# EAGLE design prototype_v6 (EAGLE 9.6.2)
AUTHOR: Cole Stanton / Aaron Tran; BOARD_NAME: 507 PROTOTYPE; DOC_NUM: 1; PROJECT_NAME: 507 DESIGN PROJECT; REVISION: 0
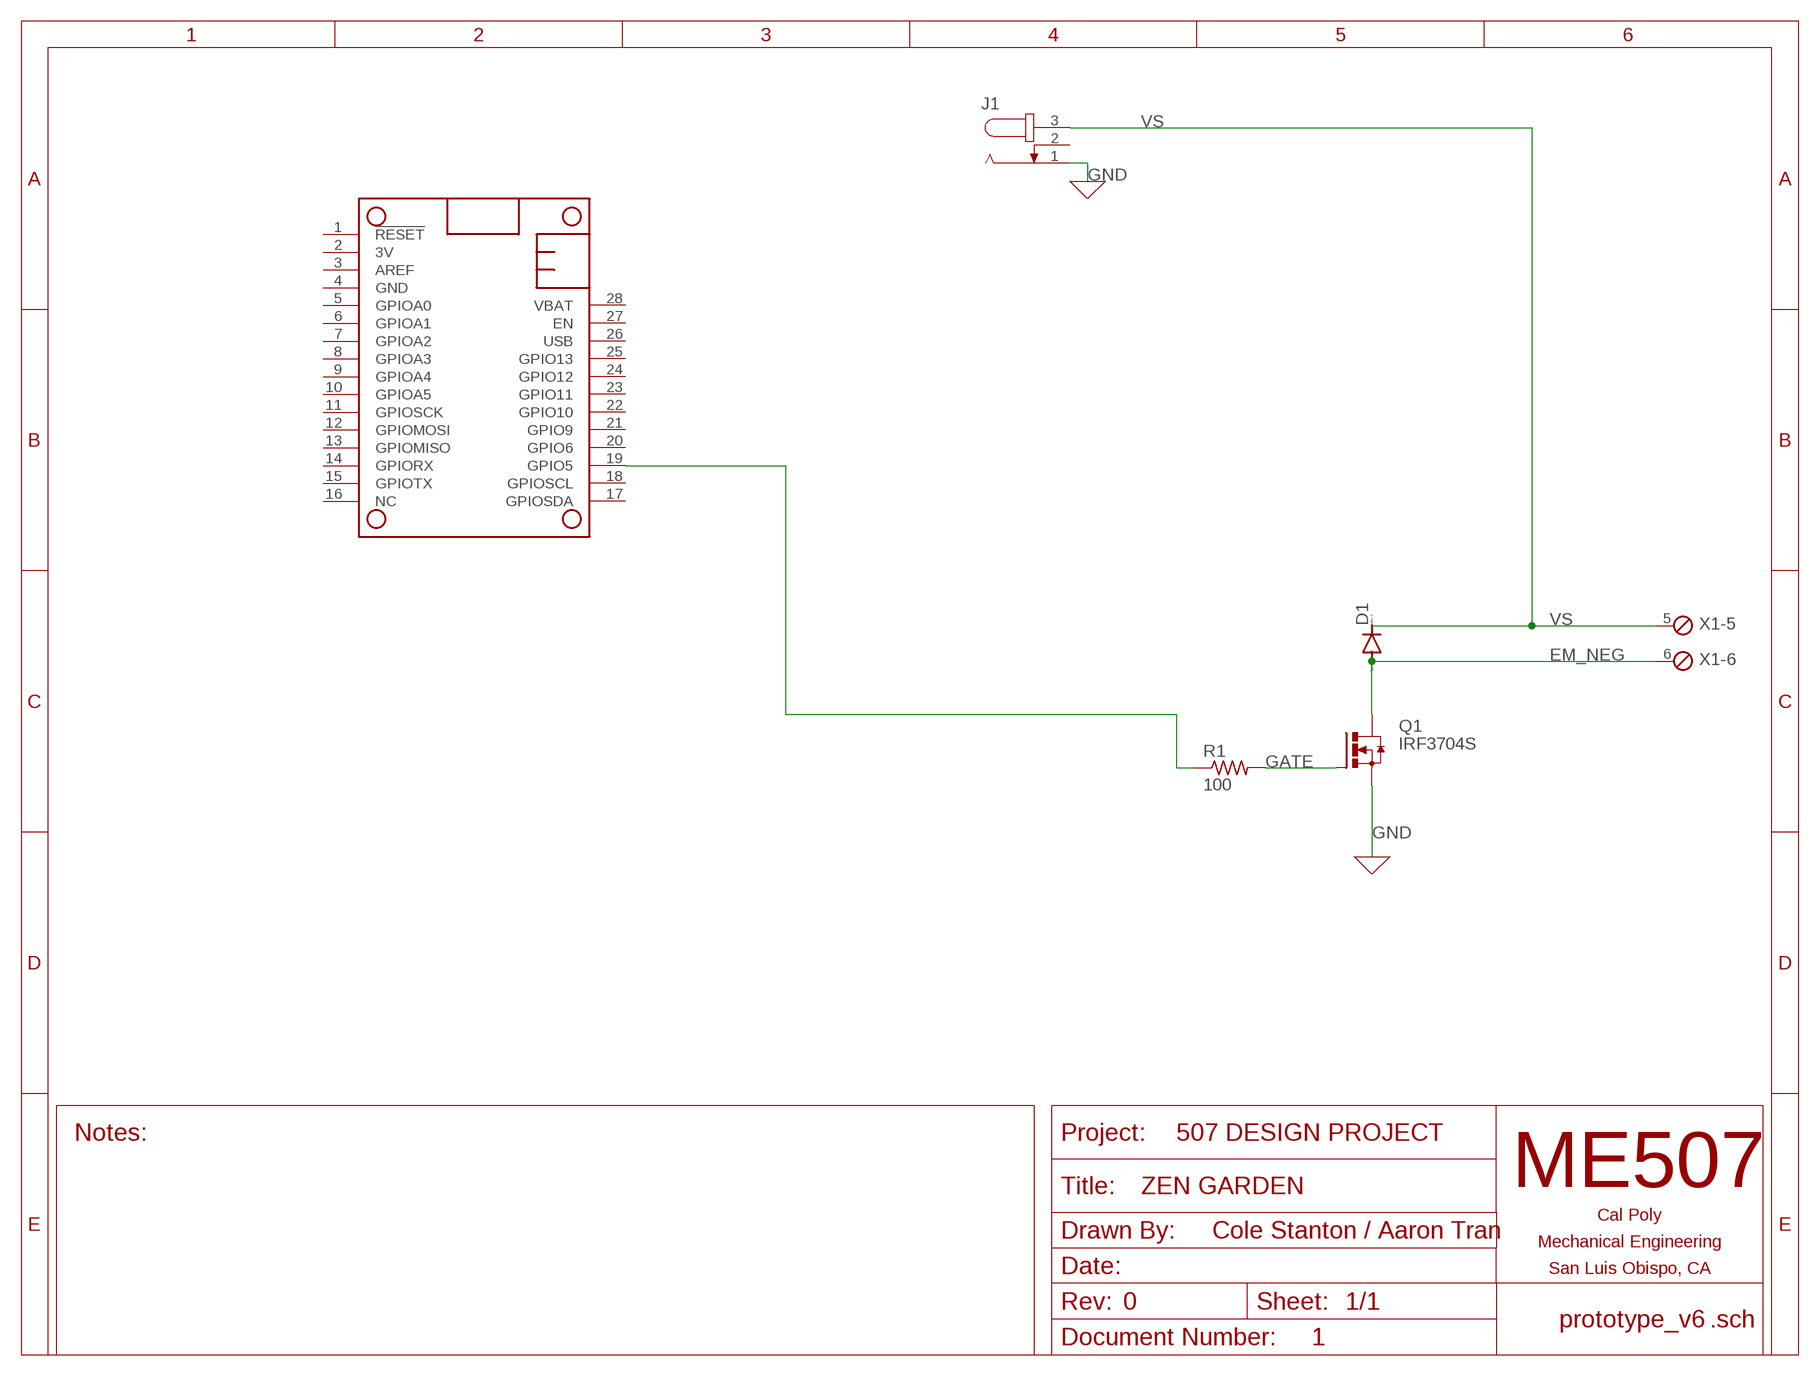
[diagram p0: schematic, sheet 1]
FRAME1 (TITLEBLOCK_LET_L): BOARD_NAME: ZEN GARDEN

## Parts
D1  DIODE-DO-214AC  [DO-214AC]
J1  JACK-PLUG1  [SPC4078]
MS1  FEATHERWINGEXTENDED_BOTH_ENDS  [FEATHERWING]
Q1  IRF3704S  [D2PACK]
R1  100  R-US_R0805  [R0805]
X1  SCREWTERM_6P_381  [6POL381]

## Nets
EM_NEG: D1.A Q1.2(D) X1.6
GATE: Q1.1(G) R1.2
GND: J1.1 Q1.3(S)
N$21: MS1.19(GPIO5) R1.1
VS: D1.C J1.3 X1.5
Unconnected: J1.2 MS1.1(!RESET) MS1.2(3V) MS1.3(AREF) MS1.5(GPIOA0) MS1.6(GPIOA1) MS1.7(GPIOA2) MS1.8(GPIOA3) MS1.9(GPIOA4) MS1.10(GPIOA5) MS1.11(GPIOSCK) MS1.12(GPIOMOSI) MS1.13(GPIOMISO) MS1.14(GPIORX) MS1.15(GPIOTX) MS1.16(NC) MS1.17(GPIOSDA) MS1.18(GPIOSCL) MS1.20(GPIO6) MS1.21(GPIO9) MS1.22(GPIO10) MS1.23(GPIO11) MS1.24(GPIO12) MS1.25(GPIO13) MS1.26(USB) MS1.27(EN) MS1.28(VBAT) X1.1 X1.2 X1.3 X1.4

## Power pins joined to a net without a drawn wire
GND: MS1.4(GND)

## Library data of the parts
D1 = diode:DIODE-: DIODE
J1 = con-jack:JACK-PLUG: DC POWER JACK Power Jack, DC, Right Angle, Through Hole, Rated 5A at 16VDC, PC Terminals Distributor: Farnell (www.Farnell.de) Drawing: 84N1161.pdf / 84N1162.pdf Manufacturer: SPC Technology (www.spctechnology.com) Type: SPC4077 / SPC 4078; OC_FARNELL: unknown; OC_NEWARK: unknown
MS1 = ME507:FEATHERWING: AdaFruitTM Feather Wing A modified version of a Featherwing, the add-on board for an AdaFruit(tm) Feather development board. There is a standard size version which is the same size as the Feather board on which the microcontroller hangs out. There is also an extended version, with each and longer by a quarter inch to allow for connectors such as screw terminals which aren't hidden under another board if this wing isn't on the top of the board stack. The pins are named in a generic fashion; these names do not necessarily correspond to Arduino or Python pin numbers. The designer must refer to the pinout diagram for each specific Feather board to find the functions of each pin.
Q1 = transistor-power:IRF3704: SMPS MOSFET HEXFET® Power MOSFET Source: http://www.irf.com/product-info/datasheets/data/irf3704.pdf
R1 = rcl:R-US_: RESISTOR, American symbol; SPICEPREFIX: R
X1 = ME507 (1):SCREWTERM_6P: Screw Terminal Block This part is designed for a screw terminal connector. The 2.54mm (0.100 inch) foorprint can also be used for male or female pin headers such as those on most development boards. One can also solder wires directly into the holes, though this makes modifications or repairs to the system more inconvenient. Larger versions can carry more current.

## Board
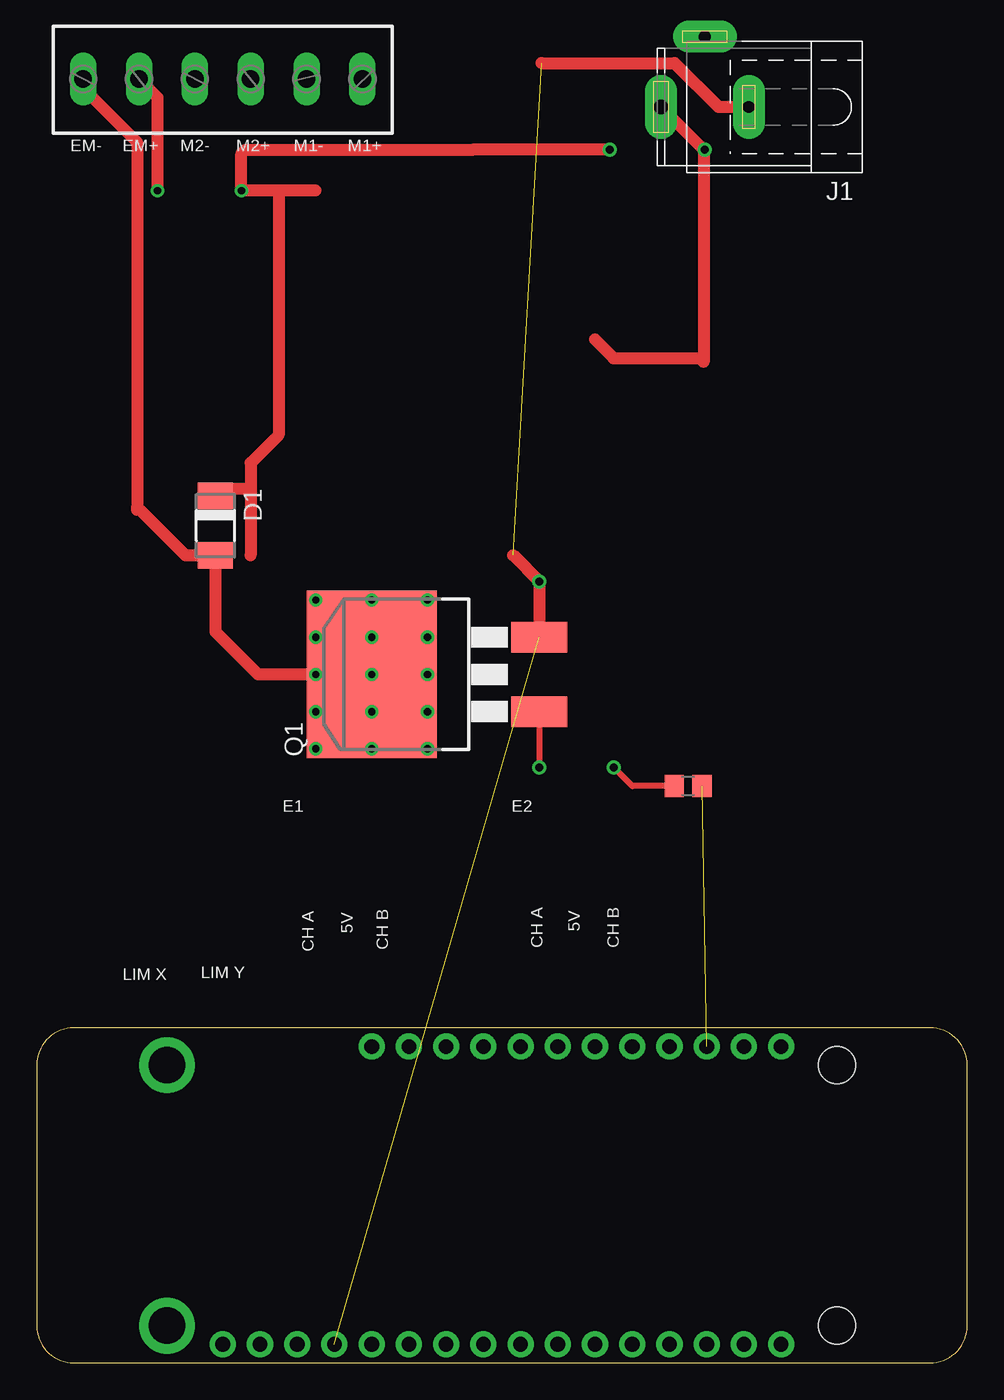
[diagram p1: board, top side]
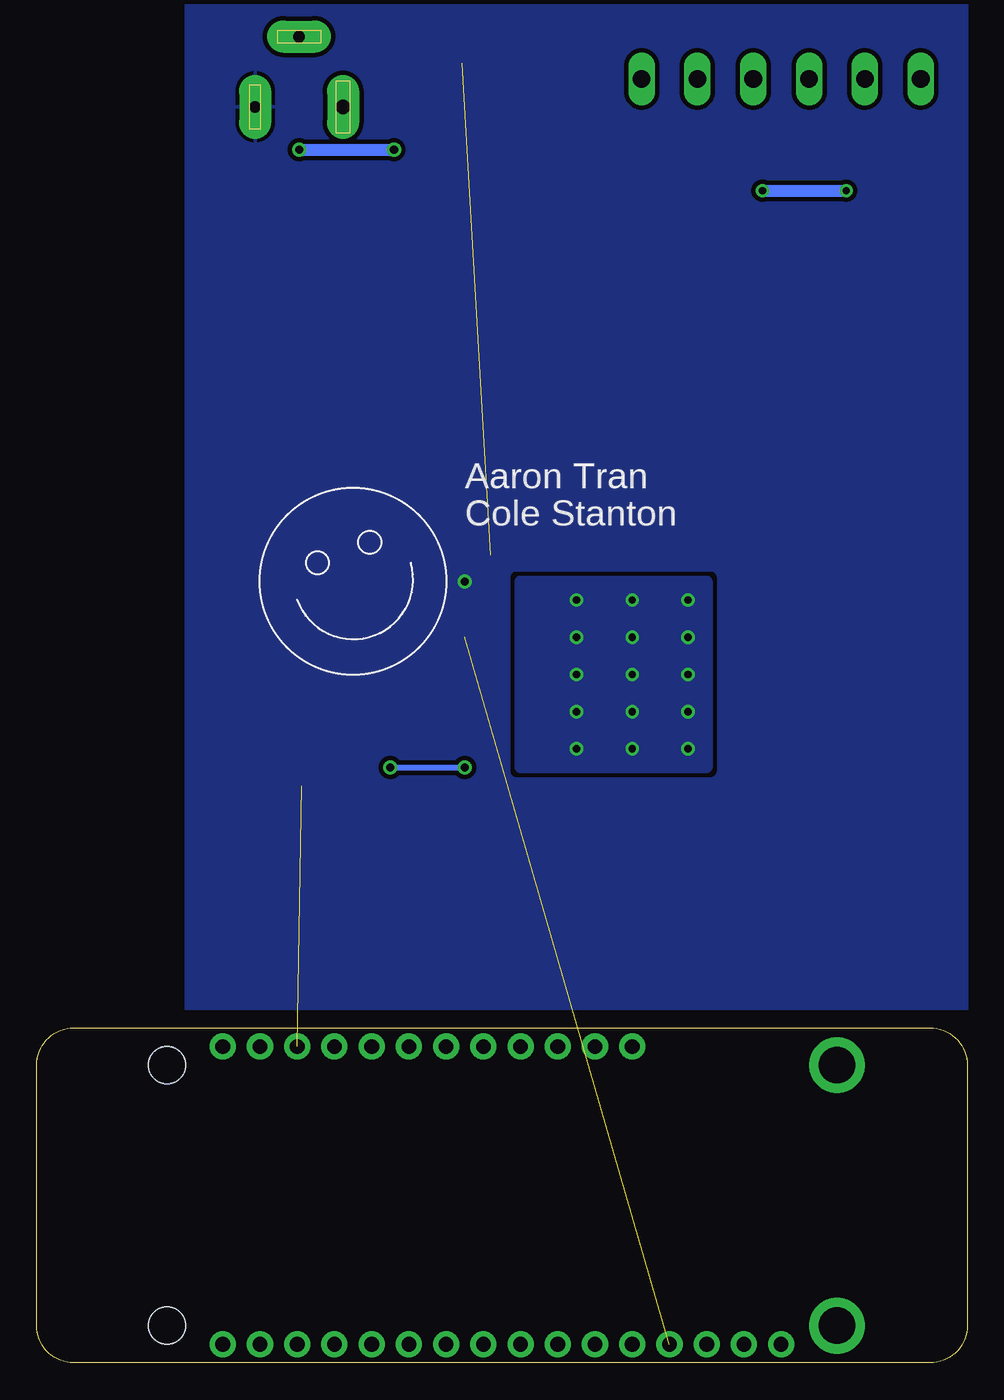
[diagram p2: board, bottom side, seen from below]

Size 63.5 x 22.86 mm. Coordinates in mm from the lower left corner, seen from the top.
Copper layers (1*16): Top 0.035mm / dielectric 1.5mm / Bottom 0.035mm
Design rules "default": minimum track width 6mil, minimum drill 0.35mm, track to track 6mil, track to pad 6mil, pad to pad 6mil, via to via 6mil, smd to smd 6mil, copper to edge 40mil, drill to drill 6mil, minimum pad ring 10mil, minimum via ring 8mil, stop-mask expansion 4mil, vias tented up to drill 0mil, thermal gap 10mil

### Footprints (pad centres in the part's own frame; a part is rotated, then mirrored left to right if it is on the bottom)
DO-214AC = smd 1.8 x 2.4: A 2.025,0; C -2.025,0
SPC4078 = drill 0.8 pad 2.184 long: 1 -3,0; 2 0,-4.8 | drill 1 pad 2.184 long: 3 3,0
FEATHERWING = drill 1 pad 1.778: 1 6.35,1.27; 2 8.89,1.27; 3 11.43,1.27; 4 13.97,1.27; 5 16.51,1.27; 6 19.05,1.27; 7 21.59,1.27; 8 24.13,1.27; 9 26.67,1.27; 10 29.21,1.27; 11 31.75,1.27; 12 34.29,1.27; 13 36.83,1.27; 14 39.37,1.27; 15 41.91,1.27; 16 44.45,1.27; 17 44.45,21.59; 18 41.91,21.59; 19 39.37,21.59; 20 36.83,21.59; 21 34.29,21.59; 22 31.75,21.59; 23 29.21,21.59; 24 26.67,21.59; 25 24.13,21.59; 26 21.59,21.59; 27 19.05,21.59; 28 16.51,21.59 | drill 2.5 pad 3.81: P$1 2.54,20.32; P$2 2.54,2.54 | hole 2.54: 48.26,20.32; 48.26,2.54
D2PACK = smd 2.083 x 3.81: 1 -2.54,-8.89; 3 2.54,-8.89 | smd 11.43 x 8.89: 2 0,2.54
R0805 = smd 1.3 x 1.5: 1 -0.95,0; 2 0.95,0
6POL381 = drill 1.2 pad 1.778 long: 1 -9.525,0; 2 -5.715,0; 3 -1.905,0; 4 1.905,0; 5 5.715,0; 6 9.525,0

### Placement (x,y rotation side)
D1  12.19,57.15 270 top  (outside the outline)
J1  45.59,85.72 180 top  (outside the outline)
MS1  6.35,0 0 top
Q1  25.4,46.99 90 top  (outside the outline)
R1  44.45,39.37 180 top  (outside the outline)
X1  12.7,87.63 180 top  (outside the outline)

### Tracks (layer width: path | path; a pad name or v marks a point on that pad's centre or on a via)
EM_NEG
  Top 0.813: X1.6 3.17,87 6.86,83.31 6.86,58.42 | 6.86,58.42 6.86,58.22 | 25.4,46.99 Q1.2 15.12,46.99 12.19,49.92 D1.A 10.15,55.12 6.86,58.42
GATE  (via drill 0.55)
  Top 0.406: R1.2 40.64,39.37 v39.37,40.64 | Q1.1 v34.29,40.64
  Bottom 0.406: v39.37,40.64 v34.29,40.64
GND  (via drill 0.55)  (2 unrouted)
  Top 0.813: Q1.3 v34.29,53.34 32.51,55.12 | J1.1 46.53,85.72 43.53,88.72 34.46,88.72
  pour Bottom (isolate 0.305, rank 4): 0,92.71 0,24.13 53.34,24.13 53.34,92.71
N$21  (1 unrouted)
  Top 0.406: 45.72,39.37 R1.1
SINK  (via drill 0.5)
  other vias: 19.05,52.07 19.05,49.53 19.05,46.99 19.05,44.45 19.05,41.91 22.86,52.07 22.86,49.53 22.86,46.99 22.86,44.45 22.86,41.91 26.67,41.91 26.67,44.45 26.67,46.99 26.67,49.53 26.67,52.07
  pour Bottom: 17.78,53.34 17.78,40.64 30.48,40.64 30.48,53.34
VS  (via drill 0.5, 0.55)
  Top 0.813: v45.59,82.8 45.52,82.73 | 45.52,82.73 45.52,68.58 | 38.1,69.85 39.37,68.58 45.52,68.58 | 45.52,68.58 45.52,68.31 | J1.3 45.52,82.8 45.52,82.73 | 19.04,80.01 16.51,80.01 | 16.51,80.01 v13.97,80.01 13.97,82.55 14.22,82.8 29.73,82.8 v39.12,82.8 | 16.51,80.01 16.51,63.33 14.61,61.43 14.61,59.69 | 14.61,59.69 14.61,55.12 | v8.26,80.01 8.26,86.36 X1.5 | D1.C 12.71,59.69 14.61,59.69
  Bottom 0.813: v45.59,82.8 v39.12,82.8 | v39.12,82.8 | v13.97,80.01 v8.26,80.01

### Text on the board
tNames: EM- | EM+ | M2- | M2+ | M1- | M1+ | E1 | E2 | 5V | 5V | CH A | CH B | CH A | CH B | LIM X | LIM Y
bNames: Aaron Tran | Cole Stanton